# Altium schematic sheet Glucometer-I.C.- RF Module.SchDoc
size A4; PageSetup: Record=PageOptions|CenterHorizontal=True|CenterVertical=True|PrintScale=1.00|XCorrection=1.00|YCorrection=1.00|PrintKind=1|BorderSize=5000000|LeftOffset=0|BottomOffset=0|Orientation=1|PaperLength=1000|PaperWidth=1000|Scale=100|PaperSource=7|PrintQuality=-4|MediaType=1|DitherType=10|PaperKind=A4|PrintScaleMode=1
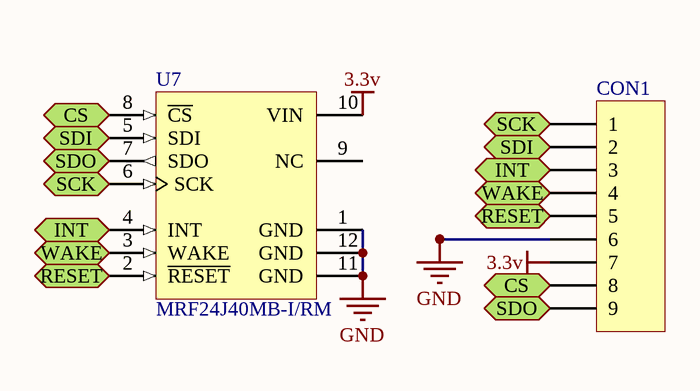
[diagram p0: Glucometer-I.C.- RF Module.SchDoc]

## Parts
CON1  Header 9  [HDR1X9]  (value not drawn)
U7  MRF24J40MB-I/RM  [MRF24J40MB]

## Ports
CS, INT, RESET, SCK, SDI, SDO, WAKE

## Nets
3.3v: CON1.7 U7.10(VIN)
GND: CON1.6 U7.1(GND) U7.11(GND) U7.12(GND)
CS: CON1.8 U7.8(~{CS}) ; port CS
INT: CON1.3 U7.4(INT) ; port INT
RESET: CON1.5 U7.2(~{RESET}) ; port RESET
SCK: CON1.1 U7.6(SCK) ; port SCK
SDI: CON1.2 U7.5(SDI) ; port SDI
SDO: CON1.9 U7.7(SDO) ; port SDO
WAKE: CON1.4 U7.3(WAKE) ; port WAKE

Not connected (* = marked no-connect by the designer): U7 9(NC)

## Library data of the parts
CON1 = Header 9: Header, 9-Pin; LatestRevisionDate: 17-Jul-2002; LatestRevisionNote: Re-released for DXP Platform.; Publisher: Altium Limited
U7 = MRF24J40MB-I/RM: 2.4 GHz IEEE Std. 802.15.4, 20 dBm RF Transceiver 12-Pin Module, Industrial Temperature; Published: 2-Dec-2009; DatasheetVersion: revB, Aug-2009; PackageVersion: Aug-2009; PackageReference: MRF24J40MB; Publisher: Altium Limited; PackageDescription: Transceiver Module; SM; 12 Leads; Body 1.3 x 0.9 x 0.1" (LxWxH), 0.1" Pitch; Supplier 1: Digi-Key; Supplier Part Number 1: MRF24J40MB-I/RM-ND; Supplier 2: Farnell; Supplier Part Number 2: 175519901; Supplier 3: Farnell; Supplier Part Number 3: 1755199; ComponentLink1Description: Datasheet; ComponentLink1URL: http://ww1.microchip.com/downloads/en/DeviceDoc/70599B.pdf; ComponentLink2Description: Packaging Specification; ComponentLink2URL: http://www.microchip.com/stellent/groups/techpub_sg/documents/packagingspec/en012702.pdf; ComponentLink3Description: Microchip.com Home; ComponentLink3URL: http://www.microchip.com/